# Altium schematic sheet wisp-6-mcu.SchDoc: MCU
size B; SheetNumber: 2; SheetTotal: 4
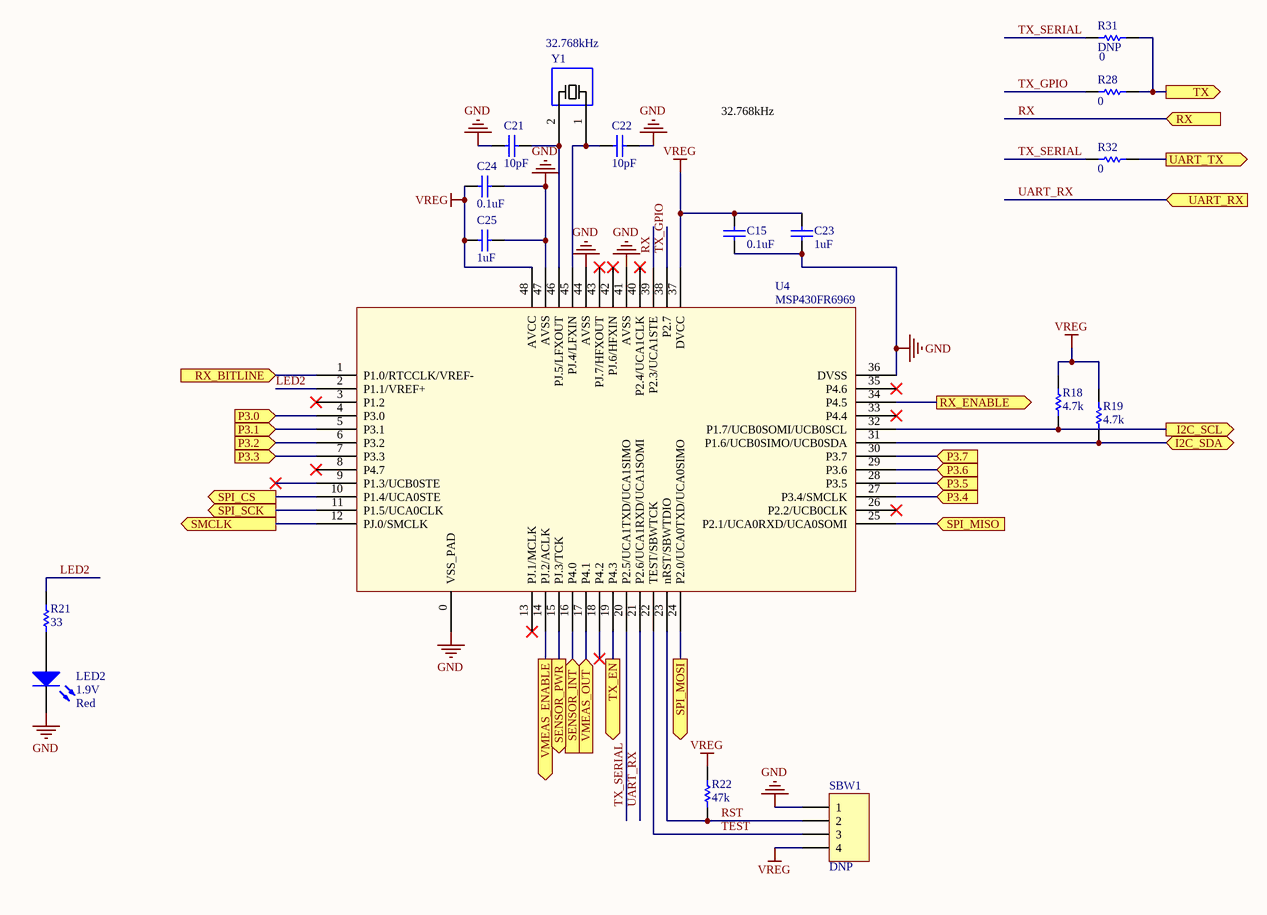
[diagram p0: wisp-6-mcu.SchDoc]

## Parts
C15  value 0.1uF  [0402]  (hidden comment: Generic ceramic capacitor)
C21  value 10pF  [0402]  (hidden comment: Generic ceramic capacitor)
C22  value 10pF  [0402]  (hidden comment: Generic ceramic capacitor)
C23  value 1uF  [0402]  (hidden comment: Generic ceramic capacitor)
C24  value 0.1uF  [0402]  (hidden comment: Generic ceramic capacitor)
C25  value 1uF  [0402]  (hidden comment: Generic ceramic capacitor)
LED2  value 1.9V  Color: Red  [Diode - 0603]  (hidden comment: Generic LED)
R18  value 4.7k  [0402]  (hidden comment: Generic resistor)
R19  value 4.7k  [0402]  (hidden comment: Generic resistor)
R21  value 33  [0402]  (hidden comment: Generic resistor)
R22  value 47k  [0402]  (hidden comment: Generic resistor)
R28  value 0  [0402]  (hidden comment: Generic resistor)
R31  value DNP  Note: 0  [0402]  (hidden comment: Generic resistor)
R32  value 0  [0402]  (hidden comment: Generic resistor)
SBW1  value DNP  [MHDR1X4]  (hidden comment: MHDR1X4)
U4  MSP430FR6969  [MSP_QFN48_RGZ_PAD0]
Y1  value 32.768kHz  [XTAL [3.20mm x 1.50mm]]  (hidden comment: XTAL 2 pin)

## Ports
I2C_SCL (out), I2C_SDA (bidir), P3.0 (in), P3.1 (in), P3.2 (in), P3.3 (in), P3.4 (in), P3.5 (in), P3.6 (in), P3.7 (in), RX (in), RX_BITLINE (in), RX_ENABLE (out), SENSOR_INT (in), SENSOR_PWR (out), SMCLK (out), SPI_CS (out), SPI_MISO (in), SPI_MOSI (out), SPI_SCK (out), TX (out), TX_EN (out), UART_RX (in), UART_TX (out), VMEAS_ENABLE (out), VMEAS_OUT (in)

## Nets
GND: C15.1 C21.1 C22.2 C23.1 C24.2 C25.2 LED2.2(K) SBW1.1 U4.0(VSS_PAD) U4.36(DVSS) U4.41(AVSS) U4.44(AVSS) U4.47(AVSS)
VREG: C15.2 C23.2 C24.1 C25.1 R18.2 R19.2 R22.2 SBW1.4 U4.37(DVCC) U4.48(AVCC)
I2C_SCL: R18.1 U4.32(P1.7/UCB0SOMI/UCB0SCL) ; port I2C_SCL
I2C_SDA: R19.1 U4.31(P1.6/UCB0SIMO/UCB0SDA) ; port I2C_SDA
LED2: R21.2 U4.2(P1.1/VREF+)
P3.0: U4.4(P3.0) ; port P3.0
P3.1: U4.5(P3.1) ; port P3.1
P3.2: U4.6(P3.2) ; port P3.2
P3.3: U4.7(P3.3) ; port P3.3
P3.4: U4.27(P3.4/SMCLK) ; port P3.4
P3.5: U4.28(P3.5) ; port P3.5
P3.6: U4.29(P3.6) ; port P3.6
P3.7: U4.30(P3.7) ; port P3.7
RST: R22.1 SBW1.2 U4.23(nRST/SBWTDIO)
RX: U4.39(P2.3/UCA1STE) ; port RX
RX_BITLINE: U4.1(P1.0/RTCCLK/VREF-) ; port RX_BITLINE
RX_ENABLE: U4.34(P4.5) ; port RX_ENABLE
SENSOR_INT: U4.16(P4.0) ; port SENSOR_INT
SENSOR_PWR: U4.15(PJ.3/TCK) ; port SENSOR_PWR
SMCLK: U4.12(PJ.0/SMCLK) ; port SMCLK
SPI_CS: U4.10(P1.4/UCA0STE) ; port SPI_CS
SPI_MISO: U4.25(P2.1/UCA0RXD/UCA0SOMI) ; port SPI_MISO
SPI_MOSI: U4.24(P2.0/UCA0TXD/UCA0SIMO) ; port SPI_MOSI
SPI_SCK: U4.11(P1.5/UCA0CLK) ; port SPI_SCK
TEST: SBW1.3 U4.22(TEST/SBWTCK)
TX: R28.1 R31.1 ; port TX
TX_EN: U4.19(P4.3) ; port TX_EN
TX_GPIO: R28.2 U4.38(P2.7)
TX_SERIAL: R31.2 R32.2 U4.20(P2.5/UCA1TXD/UCA1SIMO)
UART_RX: U4.21(P2.6/UCA1RXD/UCA1SOMI) ; port UART_RX
UART_TX: R32.1 ; port UART_TX
VMEAS_ENABLE: U4.14(PJ.2/ACLK) ; port VMEAS_ENABLE
VMEAS_OUT: U4.17(P4.1) ; port VMEAS_OUT
NetC21_2: C21.2 U4.46(PJ.5/LFXOUT) Y1.2
NetC22_1: C22.1 U4.45(PJ.4/LFXIN) Y1.1
NetLED2_1: LED2.1(A) R21.1

Not connected (* = marked no-connect by the designer): U4 3(P1.2)* 8(P4.7)* 9(P1.3/UCB0STE)* 13(PJ.1/MCLK)* 18(P4.2)* 26(P2.2/UCB0CLK)* 33(P4.4)* 35(P4.6)* 40(P2.4/UCA1CLK)* 42(PJ.6/HFXIN)* 43(PJ.7/HFXOUT)*

## Notes on the sheet
- 32.768kHz

## Library data of the parts
C15 C24 = C-0.1uF-10V-X5R-0402: CAP CER 100nF/0.1UF 10V X5R 0402; Manufacturer: Samsung Electro-Mechanics; Manufacturer Part Number: CL05A104KP5NNNC; Rating: 10V, -55C~85C; Tolerance: +-10%; Digi-Key Part Number: 1276-1022-1-ND; Note: *
C21 C22 = C-10pF-50V-C0G-0402: CAP CER 10PF 50V C0G/NP0 0402; Manufacturer: Samsung Electro-Mechanics; Manufacturer Part Number: CL05C100DB5NNNC; Rating: 10V, -55~125C; Tolerance: +-0.5pF; Digi-Key Part Number: 1276-1625-1-ND; Note: *
C23 C25 = C-1uF-10V-X5R-0402: CAP CER 1UF 10V X5R 0402; Manufacturer: Samsung Electro-Mechanics; Manufacturer Part Number: CL05A105KP5NNNC; Rating: 10V, -55~85C; Tolerance: +-10%; Digi-Key Part Number: 1276-1076-1-ND; Note: *
LED2 = led-red-1V9-0603: Red 629nm LED Indication - Discrete 1.9V 0603 (1608 Metric); Manufacturer: Lite-On Inc.; Manufacturer Part Number: LTST-C193KRKT-2A; Rating: 2A; Digi-Key Part Number: 160-1909-1-ND; Note: *; Tolerance: *
R18 R19 = R-4k7-0.063W-5%-0402: RES 4.7K OHM 5% 1/16W 0402; Manufacturer: YAGEO; Manufacturer Part Number: RC0402JR-074K7L; Tolerance: +-5%; Digi-Key Part Number: 311-4.7KJRCT-ND; Rating: 1/16W; Note: *
R21 = R-33-0.063W-5%-0402: 33 Ohms ±5% 0.063W, 1/16W Chip Resistor 0402 (1005 Metric) Moisture Resistant Thick Film; Manufacturer: YAGEO; Manufacturer Part Number: RC0402JR-1333RL; Tolerance: +-5%; Digi-Key Part Number: 13-RC0402JR-1333RLCT-ND; Rating: 1/16W; Note: *
R22 = R-47k-0.063W-5%-0402: RES 47K OHM 5% 1/16W 0402; Manufacturer: YAGEO; Manufacturer Part Number: RC0402JR-1047KL; Tolerance: +-5%; Digi-Key Part Number: 13-RC0402JR-1047KLCT-ND; Rating: 1/16W; Note: *
R28 R31 R32 = R-0-0.063W-*-0402: RES 0 OHM JUMPER 1/16W 0402; Manufacturer: YAGEO; Manufacturer Part Number: RC0402JR-070RL; Digi-Key Part Number: 311-0.0JRCT-ND; Rating: 1/16W; Tolerance: *
  R28 R32: Note: 0
SBW1 = MHDR1X4: Header, 4-Pin; LatestRevisionDate: 17-Jul-2002; LatestRevisionNote: Re-released for DXP Platform.; Publisher: Altium Limited
U4 = MSP430FR596X_586X_RGZ: MSP430 CPUXV2 MSP430™ FRAM Microcontroller IC 16-Bit 16MHz 64KB (64K x 8) FRAM 48-VQFN (7x7); Manufacturer Part Number: MSP430FR5969IRGZT; Manufacturer: Texas Instruments; Rating: -40~85C; Digi-Key Part Number: 296-37918-1-ND; Note: *
Y1 = XTAL_2pin: 2-pin XTAL; Manufacturer Part Number: FC-135 32.7680KA-A3; Digi-Key Part Number: *; Manufacturer: *; Rating: *; Note: *